# EAGLE design Syno_Ver3.0 (EAGLE 9.5.2)
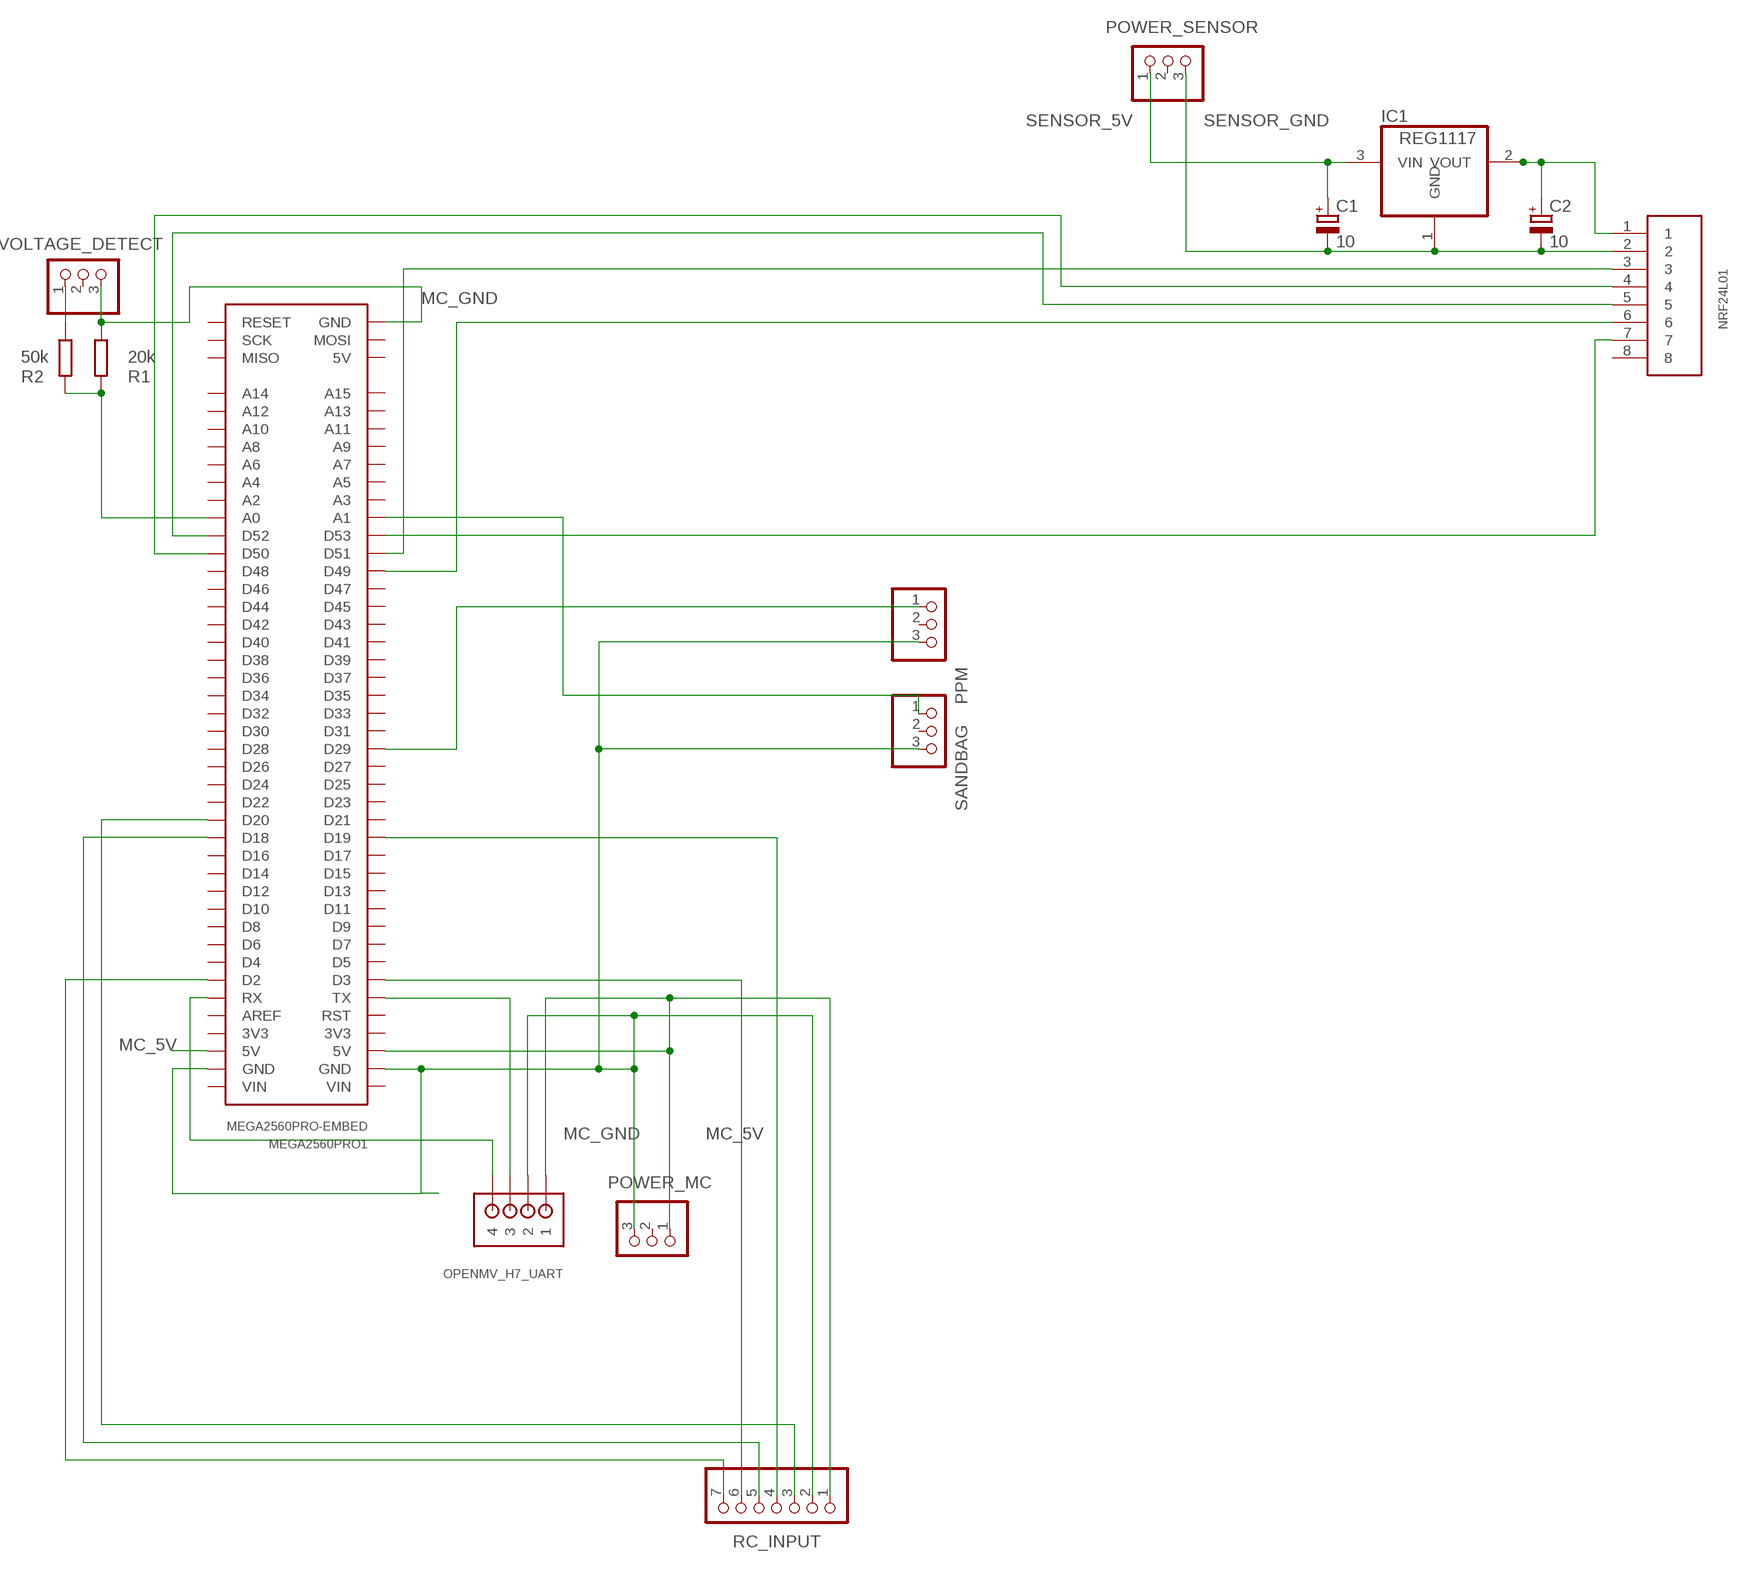
[diagram p0: schematic, sheet 1]

## Parts
C1  10  CPOL-EUE1.8-4  [E1,8-4]
C2  10  CPOL-EUE1.8-4  [E1,8-4]
IC1  REG1117  [SOT223]
MEGA2560PRO1  MEGA2560PRO-EMBED  [MEGA2560PRO-EMBED]
NRF24L01  8PIN  [B8B-PH-K-S]
OPENMV_H7_UART  JST-PH_4-PIN_HEADER  [JST_B4B-PH_HEADER]
POWER_MC  PINHD-1X3/90  [1X03/90]
POWER_SENSOR  PINHD-1X3/90  [1X03/90]
PPM  PINHD-1X3/90  [1X03/90]
R1  20k  R-EU_0204/5  [0204/5]
R2  50k  R-EU_0204/5  [0204/5]
RC_INPUT  PINHD-1X7/90  [1X07/90]
SANDBAG  PINHD-1X3/90  [1X03/90]
VOLTAGE_DETECT  PINHD-1X3/90  [1X03/90]

## Nets
MC_5V: MEGA2560PRO1.5V@1(5V) MEGA2560PRO1.5V@2(5V) OPENMV_H7_UART.P1 POWER_MC.1 RC_INPUT.1
MC_GND: MEGA2560PRO1.GND@1(GND) MEGA2560PRO1.GND@2(GND) MEGA2560PRO1.GND@3(GND) OPENMV_H7_UART.P2 POWER_MC.3 PPM.3 R1.1 RC_INPUT.2 SANDBAG.3 VOLTAGE_DETECT.3
N$1: MEGA2560PRO1.D2 RC_INPUT.7
N$2: MEGA2560PRO1.D3 RC_INPUT.6
N$3: C2.+ IC1.2(VOUT) NRF24L01.1
N$4: MEGA2560PRO1.D18 RC_INPUT.5
N$5: MEGA2560PRO1.D19 RC_INPUT.4
N$6: R2.1 VOLTAGE_DETECT.1
N$7: MEGA2560PRO1.A0 R1.2 R2.2
N$9: MEGA2560PRO1.TX OPENMV_H7_UART.P3
N$10: MEGA2560PRO1.RX OPENMV_H7_UART.P4
N$11: MEGA2560PRO1.D51 NRF24L01.3
N$12: MEGA2560PRO1.D50 NRF24L01.4
N$13: MEGA2560PRO1.D52 NRF24L01.5
N$14: MEGA2560PRO1.D20 RC_INPUT.3
N$15: MEGA2560PRO1.D49 NRF24L01.6
N$16: MEGA2560PRO1.D53 NRF24L01.7
N$17: MEGA2560PRO1.D29 PPM.1
N$18: MEGA2560PRO1.A1 SANDBAG.1
SENSOR_5V: C1.+ IC1.3(VIN) POWER_SENSOR.1
SENSOR_GND: C1.- C2.- IC1.1(GND) NRF24L01.2 POWER_SENSOR.3
Unconnected: MEGA2560PRO1.3V3@1(3V3) MEGA2560PRO1.3V3@2(3V3) MEGA2560PRO1.5V@3(5V) MEGA2560PRO1.A2 MEGA2560PRO1.A3 MEGA2560PRO1.A4 MEGA2560PRO1.A5 MEGA2560PRO1.A6 MEGA2560PRO1.A7 MEGA2560PRO1.A8 MEGA2560PRO1.A9 MEGA2560PRO1.A10 MEGA2560PRO1.A11 MEGA2560PRO1.A12 MEGA2560PRO1.A13 MEGA2560PRO1.A14 MEGA2560PRO1.A15 MEGA2560PRO1.AREF MEGA2560PRO1.D4 MEGA2560PRO1.D5 MEGA2560PRO1.D6 MEGA2560PRO1.D7 MEGA2560PRO1.D8 MEGA2560PRO1.D9 MEGA2560PRO1.D10 MEGA2560PRO1.D11 MEGA2560PRO1.D12 MEGA2560PRO1.D13 MEGA2560PRO1.D14 MEGA2560PRO1.D15 MEGA2560PRO1.D16 MEGA2560PRO1.D17 MEGA2560PRO1.D21 MEGA2560PRO1.D22 MEGA2560PRO1.D23 MEGA2560PRO1.D24 MEGA2560PRO1.D25 MEGA2560PRO1.D26 MEGA2560PRO1.D27 MEGA2560PRO1.D28 MEGA2560PRO1.D30 MEGA2560PRO1.D31 MEGA2560PRO1.D32 MEGA2560PRO1.D33 MEGA2560PRO1.D34 MEGA2560PRO1.D35 MEGA2560PRO1.D36 MEGA2560PRO1.D37 MEGA2560PRO1.D38 MEGA2560PRO1.D39 MEGA2560PRO1.D40 MEGA2560PRO1.D41 MEGA2560PRO1.D42 MEGA2560PRO1.D43 MEGA2560PRO1.D44 MEGA2560PRO1.D45 MEGA2560PRO1.D46 MEGA2560PRO1.D47 MEGA2560PRO1.D48 MEGA2560PRO1.MISO MEGA2560PRO1.MOSI MEGA2560PRO1.RESET MEGA2560PRO1.RST MEGA2560PRO1.SCK MEGA2560PRO1.VIN@1(VIN) MEGA2560PRO1.VIN@2(VIN) NRF24L01.8 POWER_MC.2 POWER_SENSOR.2 PPM.2 SANDBAG.2 VOLTAGE_DETECT.2

## Library data of the parts
C1 C2 = rcl:CPOL-EU: POLARIZED CAPACITOR, European symbol; SPICEPREFIX: C
IC1 = burr-brown:REG1117: 800mA and 1A Low Dropout (LDO) Positive Regulator 1.8V, 2.5V, 2.85V, 3.3V, 5V, and Adj; MPN: REG1117; OC_FARNELL: 1097566; OC_NEWARK: 14P6981
MEGA2560PRO1 = robotdyn:MEGA2560PRO-EMBED: Robotdyn Robotdyn Mega 2560 PRO (Embed) https://robotdyn.com/mega-2560-pro-embed-ch340g-atmega2560-16au.html
NRF24L01 = jst_eph:8PIN
OPENMV_H7_UART = srg:JST-PH_4-PIN_HEADER: 4-pin JST PH Shrouded Header, top entry P/N B4B-PH-K-S Mating connector PHR-4 Mating cable assembly: Sparkfun PRT-09916 <http://www.sparkfun.com/products/9916>
POWER_MC POWER_SENSOR PPM SANDBAG VOLTAGE_DETECT = pinhead:PINHD-1X3: PIN HEADER
R1 R2 = rcl:R-EU_: RESISTOR, European symbol; SPICEPREFIX: R
RC_INPUT = pinhead:PINHD-1X7: PIN HEADER

## Board
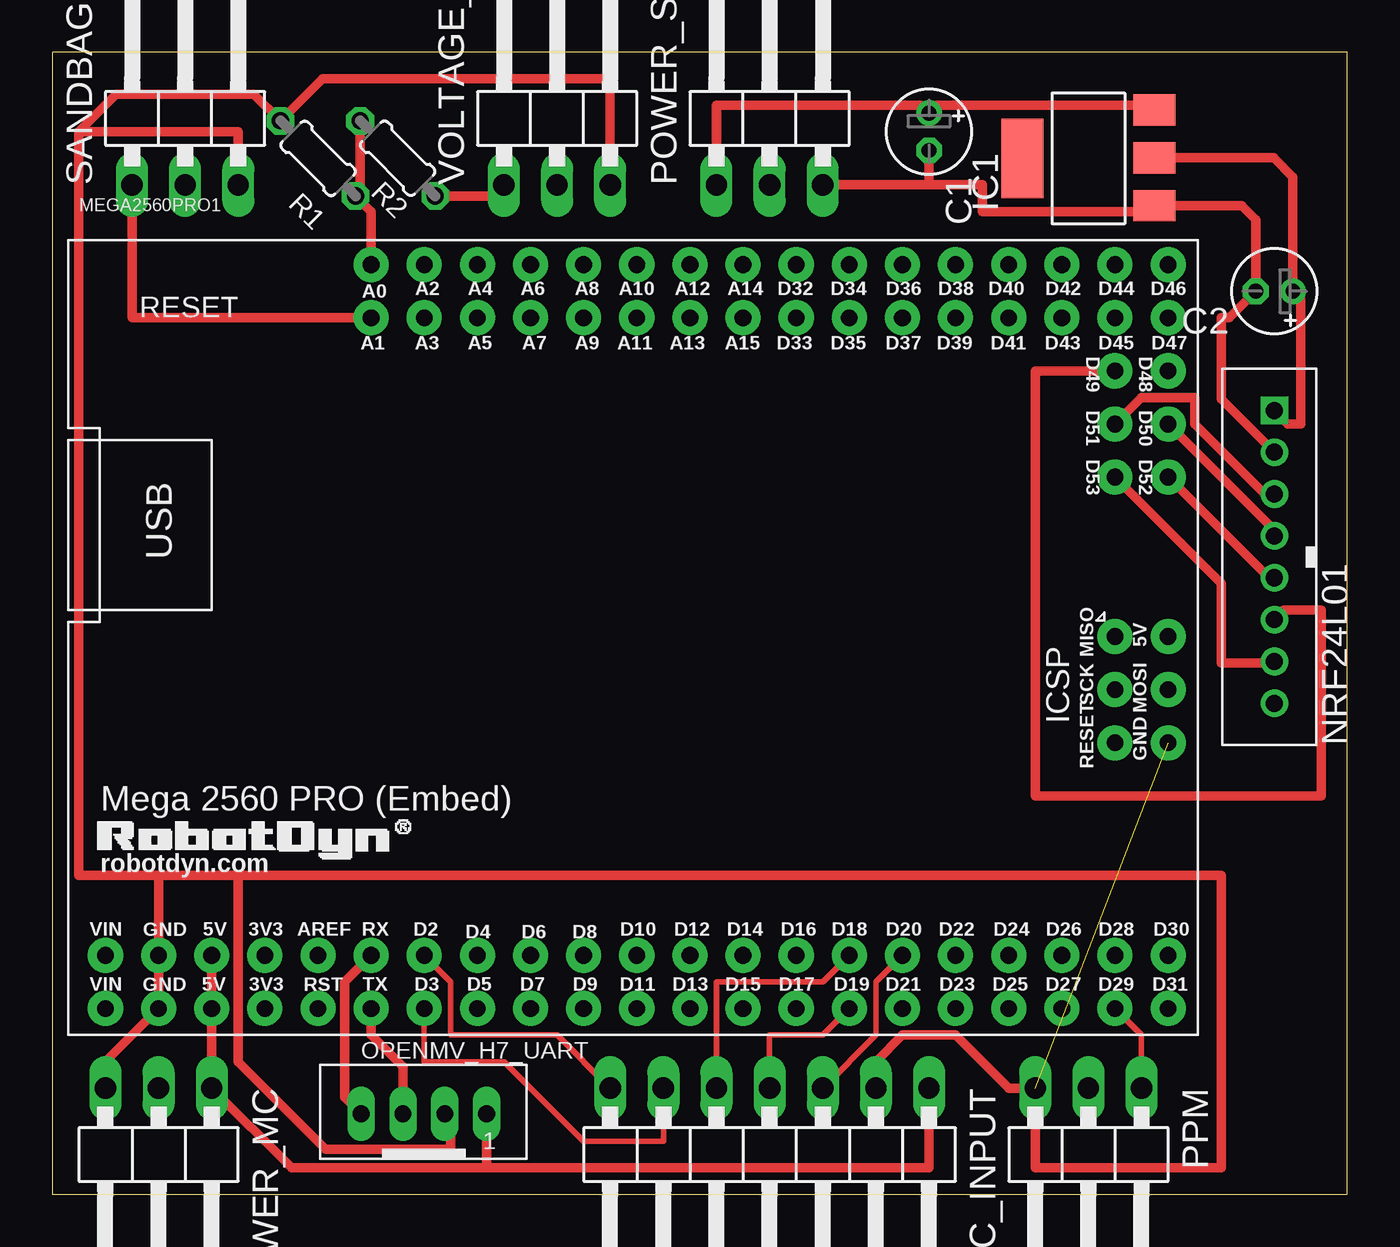
[diagram p1: board, top side]

Size 61.9 x 54.6 mm. Coordinates in mm from the lower left corner, seen from the top.
Outline: 0,0 61.9,0 61.9,54.6 0,54.6 0,0
Copper layers (1*16): Top 0.035mm / dielectric 1.5mm / Bottom 0.035mm
Design rules "default": minimum track width 6mil, minimum drill 0.35mm, track to track 6mil, track to pad 6mil, pad to pad 6mil, via to via 6mil, smd to smd 6mil, copper to edge 40mil, drill to drill 6mil, minimum pad ring 10mil, minimum via ring 8mil, stop-mask expansion 4mil, vias tented up to drill 0mil, thermal gap 10mil

### Footprints (pad centres in the part's own frame; a part is rotated, then mirrored left to right if it is on the bottom)
E1,8-4 = drill 0.711 pad 1.168: + -0.889,0 | drill 0.711 pad 1.168 octagon: - 0.889,0
SOT223 = smd 1.499 x 2.007: 1 -2.261,-3.15; 2 0.025,-3.15; 3 2.311,-3.15 | smd 3.81 x 2.007: 4 0,3.15
MEGA2560PRO-EMBED = drill 0.8 pad 1.676: 3V3@1 -25.4,-19.05; 3V3@2 -25.4,-16.51; 5V@1 -27.94,-19.05; 5V@2 -27.94,-16.51; 5V@3 17.78,-1.27; A0 -20.32,16.51; A1 -20.32,13.97; A2 -17.78,16.51; A3 -17.78,13.97; A4 -15.24,16.51; A5 -15.24,13.97; A6 -12.7,16.51; A7 -12.7,13.97; A8 -10.16,16.51; A9 -10.16,13.97; A10 -7.62,16.51; A11 -7.62,13.97; A12 -5.08,16.51; A13 -5.08,13.97; A14 -2.54,16.51; A15 -2.54,13.97; AREF -22.86,-16.51; D2 -17.78,-16.51; D3 -17.78,-19.05; D4 -15.24,-16.51; D5 -15.24,-19.05; D6 -12.7,-16.51; D7 -12.7,-19.05; D8 -10.16,-16.51; D9 -10.16,-19.05; D10 -7.62,-16.51; D11 -7.62,-19.05; D12 -5.08,-16.51; D13 -5.08,-19.05; D14 -2.54,-16.51; D15 -2.54,-19.05; D16 0,-16.51; D17 0,-19.05; D18 2.54,-16.51; D19 2.54,-19.05; D20 5.08,-16.51; D21 5.08,-19.05; D22 7.62,-16.51; D23 7.62,-19.05; D24 10.16,-16.51; D25 10.16,-19.05; D26 12.7,-16.51; D27 12.7,-19.05; D28 15.24,-16.51; D29 15.24,-19.05; D30 17.78,-16.51; D31 17.78,-19.05; D32 0,16.51; D33 0,13.97; D34 2.54,16.51; D35 2.54,13.97; D36 5.08,16.51; D37 5.08,13.97; D38 7.62,16.51; D39 7.62,13.97; D40 10.16,16.51; D41 10.16,13.97; D42 12.7,16.51; D43 12.7,13.97; D44 15.24,16.51; D45 15.24,13.97; D46 17.78,16.51; D47 17.78,13.97; D48 17.78,11.43; D49 15.24,11.43; D50 17.78,8.89; D51 15.24,8.89; D52 17.78,6.35; D53 15.24,6.35; GND@1 -30.48,-19.05; GND@2 -30.48,-16.51; GND@3 17.78,-6.35; MISO 15.24,-1.27; MOSI 17.78,-3.81; RESET 15.24,-6.35; RST -22.86,-19.05; RX -20.32,-16.51; SCK 15.24,-3.81; TX -20.32,-19.05; VIN@1 -33.02,-19.05; VIN@2 -33.02,-16.51
B8B-PH-K-S = drill 0.813 square: 1 7,0 | drill 0.813: 2 5,0; 3 3,0; 4 1,0; 5 -1,0; 6 -3,0; 7 -5,0; 8 -7,0
JST_B4B-PH_HEADER = drill 0.8 long: P1 2.98,0.048; P2 0.98,0.048; P3 -1.02,0.048; P4 -3.02,0.048
1X03/90 = drill 1.016 long: 1 -2.54,-3.81; 2 0,-3.81; 3 2.54,-3.81
0204/5 = drill 0.813 octagon: 1 -2.54,0; 2 2.54,0
1X07/90 = drill 1.016 long: 1 -7.62,-3.81; 2 -5.08,-3.81; 3 -2.54,-3.81; 4 0,-3.81; 5 2.54,-3.81; 6 5.08,-3.81; 7 7.62,-3.81

### Placement (x,y rotation side)
C1  41.91,50.8 270 top
C2  58.42,43.18 180 top
IC1  49.53,49.53 90 top
MEGA2560PRO1  35.56,27.94 0 top
NRF24L01  58.42,30.48 90 top
OPENMV_H7_UART  17.78,3.81 0 top
POWER_MC  5.08,1.27 180 top
POWER_SENSOR  34.29,52.07 0 top
PPM  49.53,1.27 180 top
R1  12.7,49.53 315 top
R2  16.51,49.53 135 top
RC_INPUT  34.29,1.27 180 top
SANDBAG  6.35,52.07 0 top
VOLTAGE_DETECT  24.13,52.07 0 top

### Tracks (layer width: path | path; a pad name or v marks a point on that pad's centre or on a via)
MC_5V
  Top 0.457: MEGA2560PRO1.5V@2 MEGA2560PRO1.5V@1 POWER_MC.1 11.43,1.27 20.76,1.27 | 20.76,1.27 41.91,1.27 RC_INPUT.1 | OPENMV_H7_UART.P1 20.76,1.27
MC_GND  (1 unrouted)
  Top 0.457: SANDBAG.3 8.89,50.8 1.27,50.8 | 1.27,50.8 1.27,15.24 5.08,15.24 | POWER_MC.3 2.54,6.35 MEGA2560PRO1.GND@1 MEGA2560PRO1.GND@2 5.08,15.24 | RC_INPUT.2 39.37,6.35 40.64,7.62 43.18,7.62 45.72,5.08 PPM.3 46.99,1.27 55.88,1.27 55.88,15.24 8.89,15.24 | 8.89,15.24 5.08,15.24 | VOLTAGE_DETECT.3 26.67,53.34 12.92,53.34 R1.1 | 8.89,15.24 8.89,6.34 13.06,2.17 19.05,2.17 19.05,3.57 OPENMV_H7_UART.P2 | 1.27,50.8 3.07,52.6 9.63,52.6 R1.1 | R1.1
N$1
  Top 0.254: MEGA2560PRO1.D2 19.05,10.16 19.05,7.62 24.13,7.62 RC_INPUT.7
N$2
  Top 0.254: MEGA2560PRO1.D3 17.78,6.35 21.59,6.35 25.4,2.54 29.21,2.54 RC_INPUT.6
N$3
  Top 0.457: IC1.2 58.4,49.55 59.31,48.64 C2.+ 59.69,42.8 59.69,36.83 59.07,36.83 NRF24L01.1
N$4
  Top 0.254: MEGA2560PRO1.D18 36.83,10.16 31.75,10.16 RC_INPUT.5
N$5
  Top 0.254: MEGA2560PRO1.D19 36.83,7.62 34.29,7.62 RC_INPUT.4
N$6
  Top 0.457: VOLTAGE_DETECT.1 21.06,47.73 R2.1
N$7
  Top 0.457: R2.2 14.71,47.95 R1.2 15.24,46.99 MEGA2560PRO1.A0
N$9
  Top 0.457: OPENMV_H7_UART.P3 16.76,6.1 15.24,7.62 MEGA2560PRO1.TX
N$10
  Top 0.457: MEGA2560PRO1.RX 13.97,10.16 13.97,4.65 OPENMV_H7_UART.P4
N$11
  Top 0.457: MEGA2560PRO1.D51 52.07,38.1 54.61,38.1 54.61,36.83 57.96,33.48 NRF24L01.3
N$12
  Top 0.457: MEGA2560PRO1.D50 58.42,31.75 NRF24L01.4
N$13
  Top 0.457: MEGA2560PRO1.D52 58.15,29.48 NRF24L01.5
N$14
  Top 0.254: MEGA2560PRO1.D20 39.37,10.16 39.37,7.62 RC_INPUT.3
N$15
  Top 0.457: MEGA2560PRO1.D49 46.99,39.37 46.99,19.05 60.66,19.05 60.66,27.94 58.88,27.94 NRF24L01.6
N$16
  Top 0.457: MEGA2560PRO1.D53 55.88,29.21 55.88,25.4 58.34,25.4 NRF24L01.7
N$17
  Top 0.254: MEGA2560PRO1.D29 52.07,7.62 PPM.1
N$18
  Top 0.457: SANDBAG.1 3.81,41.91 MEGA2560PRO1.A1
SENSOR_5V
  Top 0.457: POWER_SENSOR.1 31.75,52.07 41.53,52.07 C1.+ 42.29,52.07 52.45,52.07 IC1.3
SENSOR_GND
  Top 0.457: POWER_SENSOR.3 41.91,48.26 | 41.91,48.26 C1.- | 41.91,48.26 44.45,48.26 44.45,46.99 52.4,46.99 IC1.1 56.87,47.27 57.53,46.61 C2.- 56.26,41.91 55.88,41.91 55.88,38.02 NRF24L01.2